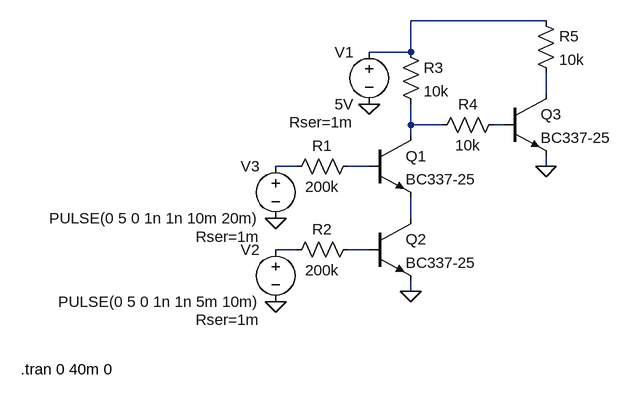
[diagram p0: schematic and.asc]
and.asc, the LTspice schematic file:
Version 4
SHEET 1 880 680
WIRE 384 -112 176 -112
WIRE 176 -64 176 -112
WIRE 176 -64 112 -64
WIRE 384 0 384 -32
WIRE 176 48 176 16
WIRE 224 48 176 48
WIRE 320 48 304 48
WIRE 176 64 176 48
WIRE 0 112 -32 112
WIRE 112 112 80 112
WIRE 384 112 384 96
WIRE 176 192 176 160
WIRE 0 240 -32 240
WIRE 112 240 80 240
WIRE 176 304 176 288
FLAG 112 16 0
FLAG -32 320 0
FLAG -32 192 0
FLAG 176 304 0
FLAG 384 112 0
SYMBOL npn 112 64 R0
SYMATTR InstName Q1
SYMATTR Value BC337-25
SYMBOL npn 112 192 R0
SYMATTR InstName Q2
SYMATTR Value BC337-25
SYMBOL voltage 112 -80 M0
WINDOW 123 0 0 Left 2
WINDOW 39 24 124 Left 2
SYMATTR SpiceLine Rser=1m
SYMATTR InstName V1
SYMATTR Value 5V
SYMBOL res 96 96 R90
WINDOW 0 0 56 VBottom 2
WINDOW 3 32 56 VTop 2
SYMATTR InstName R1
SYMATTR Value 200k
SYMBOL res 96 224 R90
WINDOW 0 0 56 VBottom 2
WINDOW 3 32 56 VTop 2
SYMATTR InstName R2
SYMATTR Value 200k
SYMBOL voltage -32 224 M0
WINDOW 123 0 0 Left 2
WINDOW 39 24 124 Left 2
SYMATTR SpiceLine Rser=1m
SYMATTR InstName V2
SYMATTR Value PULSE(0 5 0 1n 1n 5m 10m)
SYMBOL voltage -32 96 M0
WINDOW 123 0 0 Left 2
WINDOW 39 24 124 Left 2
SYMATTR SpiceLine Rser=1m
SYMATTR InstName V3
SYMATTR Value PULSE(0 5 0 1n 1n 10m 20m)
SYMBOL res 160 -80 R0
SYMATTR InstName R3
SYMATTR Value 10k
SYMBOL res 320 32 R90
WINDOW 0 0 56 VBottom 2
WINDOW 3 32 56 VTop 2
SYMATTR InstName R4
SYMATTR Value 10k
SYMBOL npn 320 0 R0
SYMATTR InstName Q3
SYMATTR Value BC337-25
SYMBOL res 368 -128 R0
SYMATTR InstName R5
SYMATTR Value 10k
TEXT -424 424 Left 2 !.tran 0 40m 0

The netlist it stands for:
* and.asc
Q1 N003 N006 N007 0 BC337-25
Q2 N007 N009 0 0 BC337-25
V1 N001 0 5V Rser=1m
R1 N006 N005 200k
R2 N009 N008 200k
V2 N008 0 PULSE(0 5 0 1n 1n 5m 10m) Rser=1m
V3 N005 0 PULSE(0 5 0 1n 1n 10m 20m) Rser=1m
R3 N001 N003 10k
R4 N004 N003 10k
Q3 N002 N004 0 0 BC337-25
R5 N001 N002 10k
.model NPN NPN
.model PNP PNP
.lib standard.bjt
.tran 0 40m 0
.backanno
.end